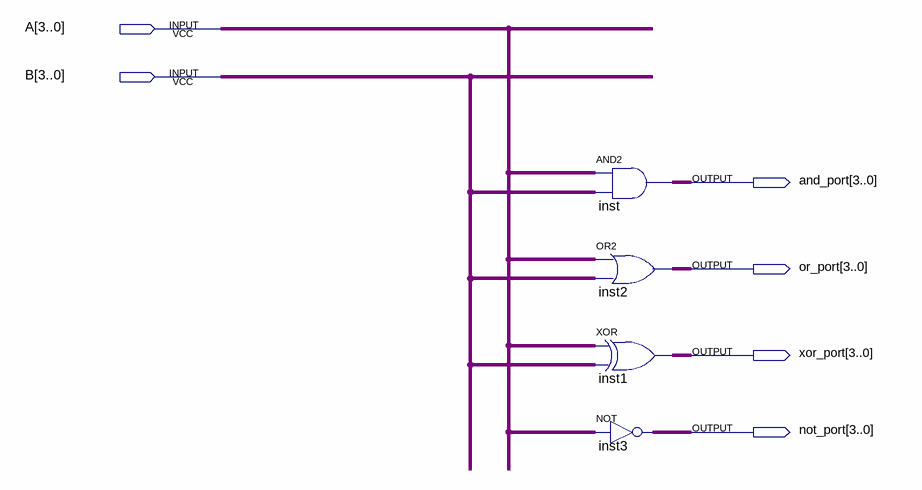
[diagram p0: schematic sheet]
// Quartus schematic circ1.bdf as structural Verilog: 4 symbols, 6 pins
module circ1 (
  input  [3:0] A,
  input  [3:0] B,
  output [3:0] and_port,
  output [3:0] or_port,
  output [3:0] xor_port,
  output [3:0] not_port
);

  assign and_port = A & B;  // AND2 inst, 4 bits wide
  assign or_port = A | B;  // OR2 inst2, 4 bits wide
  assign xor_port = A ^ B;  // XOR inst1, 4 bits wide
  assign not_port = ~A;  // NOT inst3, 4 bits wide
endmodule
